# EasyEDA schematic Placa_CLP_2021-08-01_15-29-45.json
TITLE: Placa_CLP; REV: 1.0; Date: 01/07/2021; Sheet: 1/1; Drawn By: Fernando; Company: SENAI
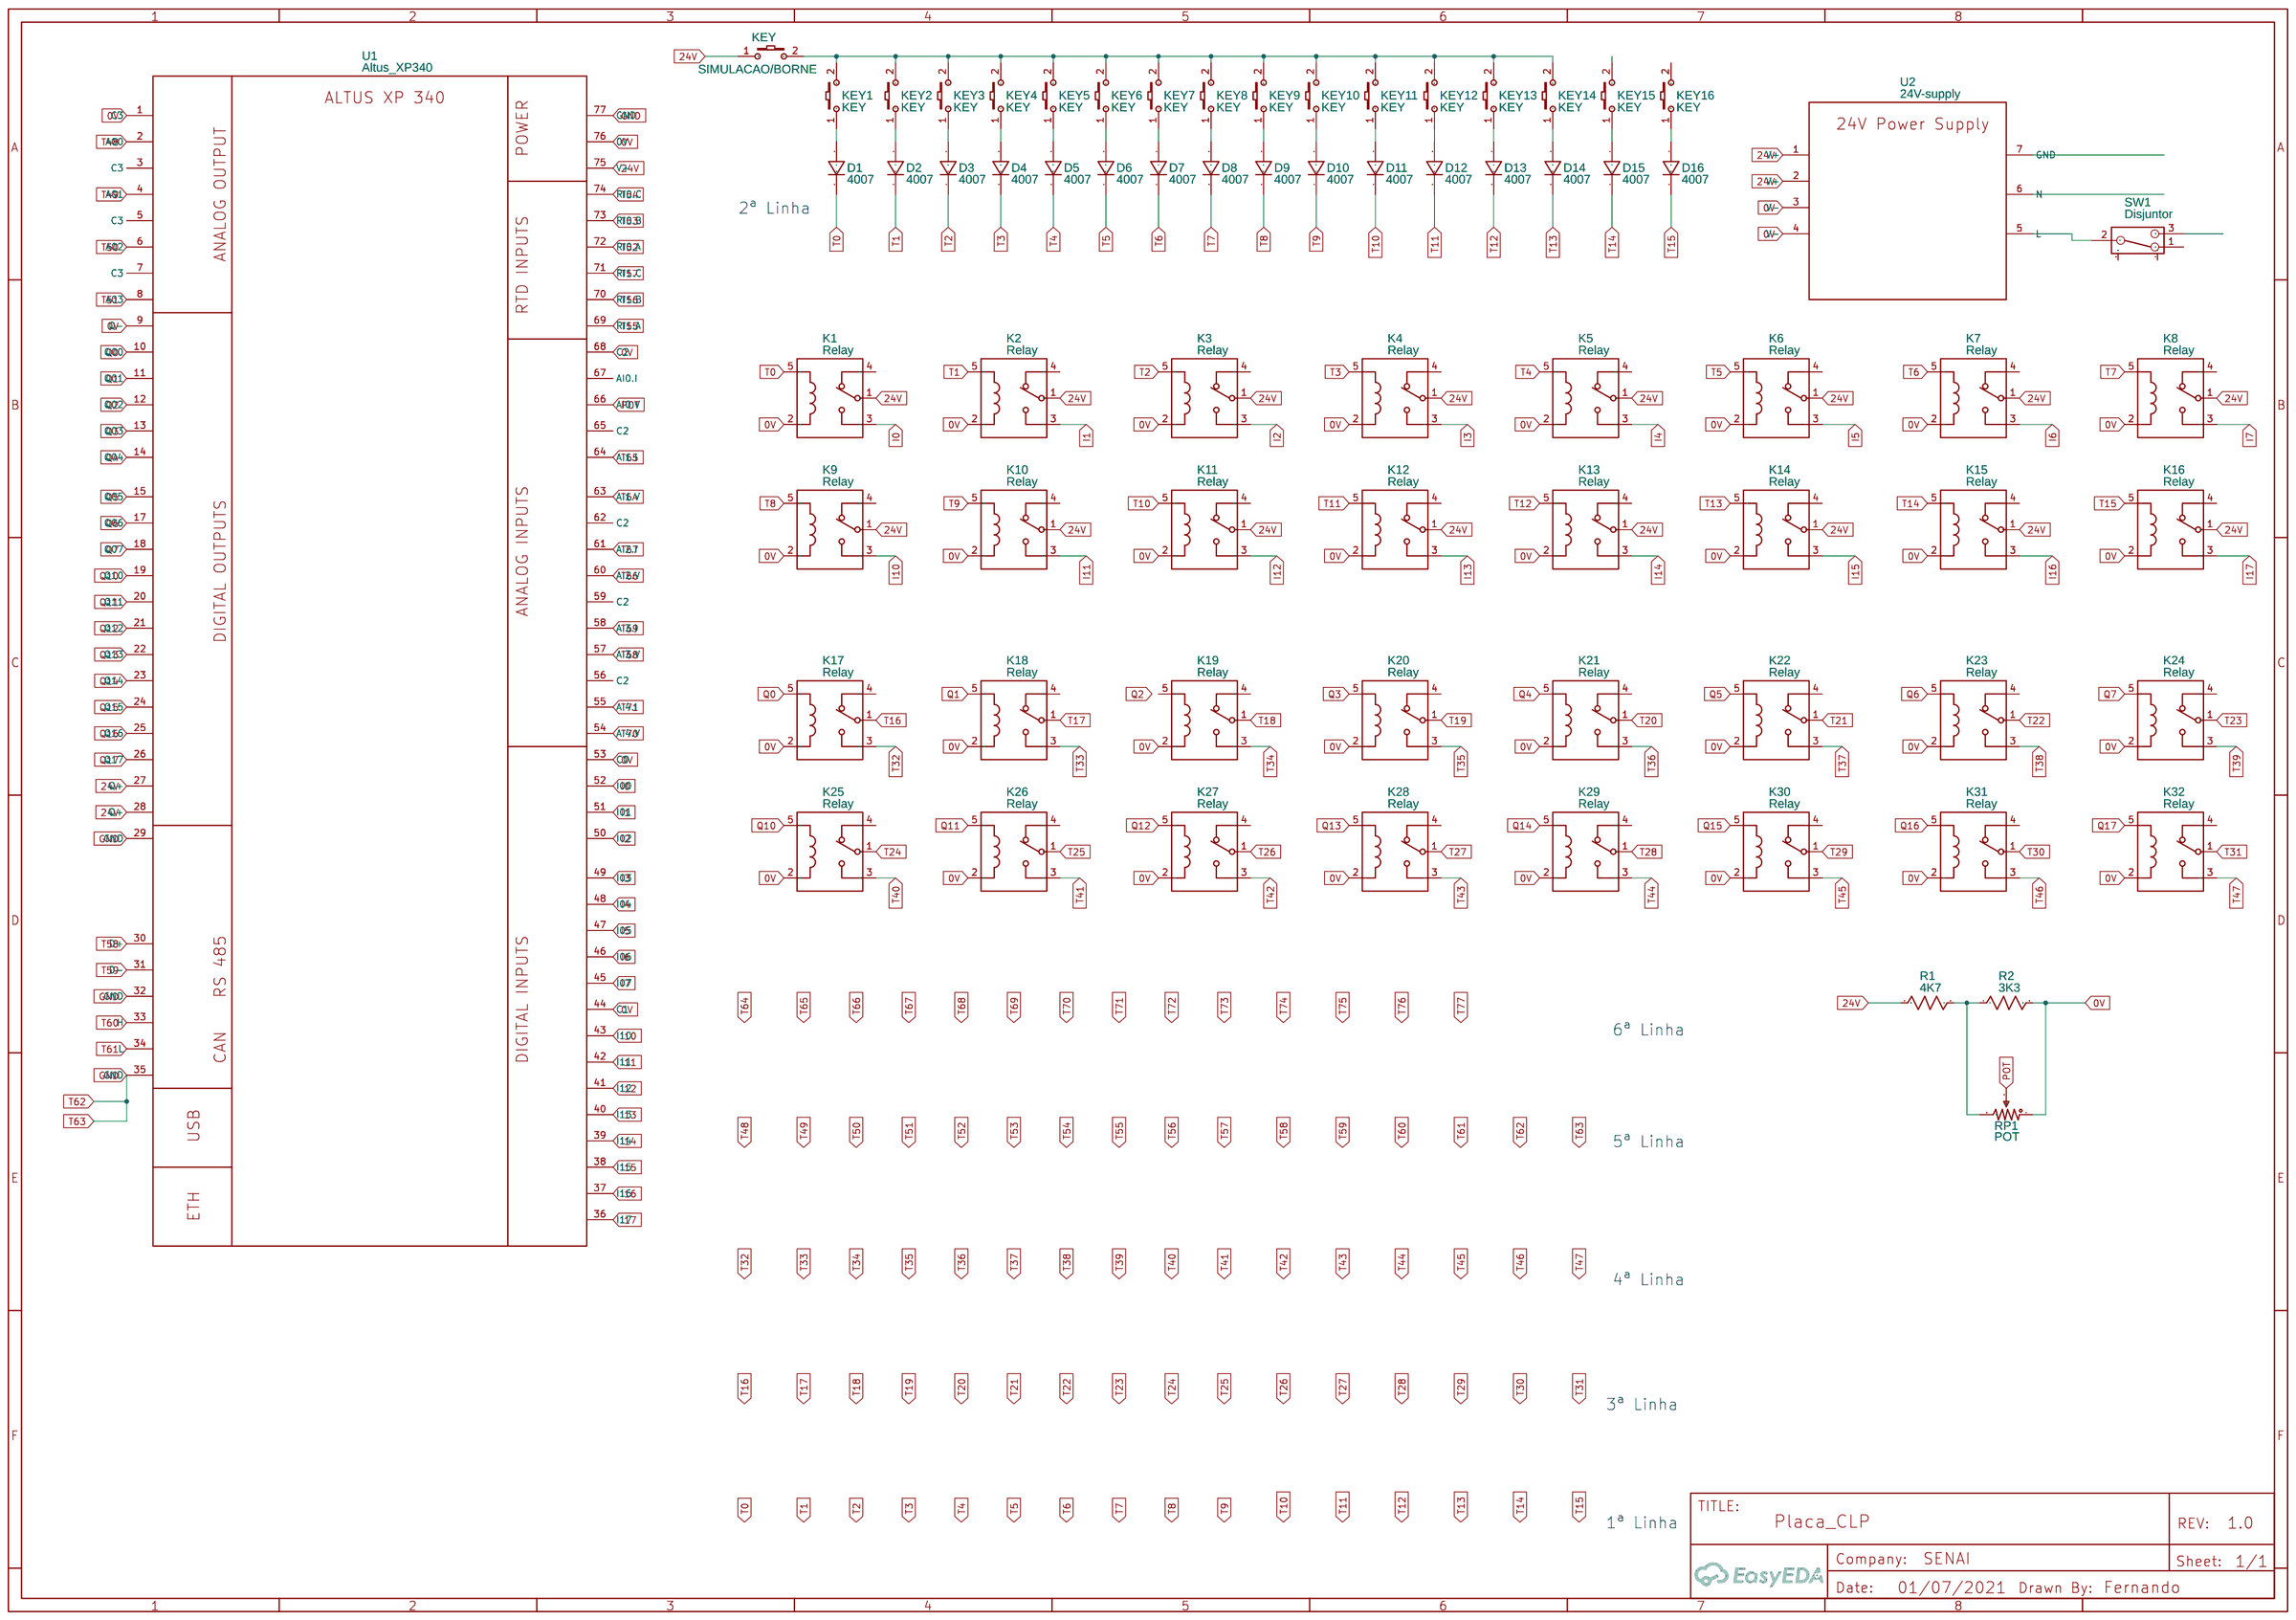
[diagram p0: schematic sheet]

## Parts
D1  4007  [DO-41_BD2.4-L4.7-P8.70-D0.9-RD]
D2  4007  [DO-41_BD2.4-L4.7-P8.70-D0.9-RD]
D3  4007  [DO-41_BD2.4-L4.7-P8.70-D0.9-RD]
D4  4007  [DO-41_BD2.4-L4.7-P8.70-D0.9-RD]
D5  4007  [DO-41_BD2.4-L4.7-P8.70-D0.9-RD]
D6  4007  [DO-41_BD2.4-L4.7-P8.70-D0.9-RD]
D7  4007  [DO-41_BD2.4-L4.7-P8.70-D0.9-RD]
D8  4007  [DO-41_BD2.4-L4.7-P8.70-D0.9-RD]
D9  4007  [DO-41_BD2.4-L4.7-P8.70-D0.9-RD]
D10  4007  [DO-41_BD2.4-L4.7-P8.70-D0.9-RD]
D11  4007  [DO-41_BD2.4-L4.7-P8.70-D0.9-RD]
D12  4007  [DO-41_BD2.4-L4.7-P8.70-D0.9-RD]
D13  4007  [DO-41_BD2.4-L4.7-P8.70-D0.9-RD]
D14  4007  [DO-41_BD2.4-L4.7-P8.70-D0.9-RD]
D15  4007  [DO-41_BD2.4-L4.7-P8.70-D0.9-RD]
D16  4007  [DO-41_BD2.4-L4.7-P8.70-D0.9-RD]
K1  Relay  [RELAY-TH_HT3F-DCXX-X-X]
K2  Relay  [RELAY-TH_HT3F-DCXX-X-X]
K3  Relay  [RELAY-TH_HT3F-DCXX-X-X]
K4  Relay  [RELAY-TH_HT3F-DCXX-X-X]
K5  Relay  [RELAY-TH_HT3F-DCXX-X-X]
K6  Relay  [RELAY-TH_HT3F-DCXX-X-X]
K7  Relay  [RELAY-TH_HT3F-DCXX-X-X]
K8  Relay  [RELAY-TH_HT3F-DCXX-X-X]
K9  Relay  [RELAY-TH_HT3F-DCXX-X-X]
K10  Relay  [RELAY-TH_HT3F-DCXX-X-X]
K11  Relay  [RELAY-TH_HT3F-DCXX-X-X]
K12  Relay  [RELAY-TH_HT3F-DCXX-X-X]
K13  Relay  [RELAY-TH_HT3F-DCXX-X-X]
K14  Relay  [RELAY-TH_HT3F-DCXX-X-X]
K15  Relay  [RELAY-TH_HT3F-DCXX-X-X]
K16  Relay  [RELAY-TH_HT3F-DCXX-X-X]
K17  Relay  [RELAY-TH_HT3F-DCXX-X-X]
K18  Relay  [RELAY-TH_HT3F-DCXX-X-X]
K19  Relay  [RELAY-TH_HT3F-DCXX-X-X]
K20  Relay  [RELAY-TH_HT3F-DCXX-X-X]
K21  Relay  [RELAY-TH_HT3F-DCXX-X-X]
K22  Relay  [RELAY-TH_HT3F-DCXX-X-X]
K23  Relay  [RELAY-TH_HT3F-DCXX-X-X]
K24  Relay  [RELAY-TH_HT3F-DCXX-X-X]
K25  Relay  [RELAY-TH_HT3F-DCXX-X-X]
K26  Relay  [RELAY-TH_HT3F-DCXX-X-X]
K27  Relay  [RELAY-TH_HT3F-DCXX-X-X]
K28  Relay  [RELAY-TH_HT3F-DCXX-X-X]
K29  Relay  [RELAY-TH_HT3F-DCXX-X-X]
K30  Relay  [RELAY-TH_HT3F-DCXX-X-X]
K31  Relay  [RELAY-TH_HT3F-DCXX-X-X]
K32  Relay  [RELAY-TH_HT3F-DCXX-X-X]
KEY1  KEY  [KEY-SMD_2P-L6.2-W3.6-LS8.0]
KEY2  KEY  [KEY-SMD_2P-L6.2-W3.6-LS8.0]
KEY3  KEY  [KEY-SMD_2P-L6.2-W3.6-LS8.0]
KEY4  KEY  [KEY-SMD_2P-L6.2-W3.6-LS8.0]
KEY5  KEY  [KEY-SMD_2P-L6.2-W3.6-LS8.0]
KEY6  KEY  [KEY-SMD_2P-L6.2-W3.6-LS8.0]
KEY7  KEY  [KEY-SMD_2P-L6.2-W3.6-LS8.0]
KEY8  KEY  [KEY-SMD_2P-L6.2-W3.6-LS8.0]
KEY9  KEY  [KEY-SMD_2P-L6.2-W3.6-LS8.0]
KEY10  KEY  [KEY-SMD_2P-L6.2-W3.6-LS8.0]
KEY11  KEY  [KEY-SMD_2P-L6.2-W3.6-LS8.0]
KEY12  KEY  [KEY-SMD_2P-L6.2-W3.6-LS8.0]
KEY13  KEY  [KEY-SMD_2P-L6.2-W3.6-LS8.0]
KEY14  KEY  [KEY-SMD_2P-L6.2-W3.6-LS8.0]
KEY15  KEY  [KEY-SMD_2P-L6.2-W3.6-LS8.0]
KEY16  KEY  [KEY-SMD_2P-L6.2-W3.6-LS8.0]
R1  4K7  [R0603]
R2  3K3  [R0603]
RP1  POT  [RES-ADJ-TH_3386P]
SIMULACAO/BORNE  KEY  [KEY-SMD_2P-L6.2-W3.6-LS8.0]
SW1  Disjuntor  [SW-TH_SK-12D02VG3]
U1  Altus_XP340
U2  24V-supply

## Library data of the parts
D1-D16 = 1N4007: Supplier: LCSC; Manufacturer: SEMTECH; Supplier Part: C106903; Contributor: LCEDA_Lib
K1-K32 = RelayHT3F-12VDC-SHG: Supplier: LCSC; Manufacturer: HTV; Supplier Part: C22022; JLCPCB Part Class: Extended Part
KEY1-KEY16 SIMULACAO/BORNE = K2-3.6×6.1_SMD: Supplier Part: C118141; Supplier: LCSC; Manufacturer Part: K2-1107ST-A4SW-06; Contributor: LCEDA_Lib; 制造商: 韩国韩荣
R1 R2 = R_0603_US: Contributor: LCEDA_Lib
RP1 = R_3386P_US: Supplier: LCSC; Contributor: LCEDA_Lib; value(Ω): 10K
SW1 = SK-12D02-VG5: Supplier: LCSC; Supplier Part: C136722; Manufacturer: Rectangular Connectors - Contacts; Contributor: LCSC
U1 = Altus_XP340: Contributor: D1Magus
U2 = 24V-supply: Contributor: D1Magus

## Nets
0V: K1.2 K2.2 K3.2 K4.2 K5.2 K6.2 K7.2 K8.2 K9.2 K10.2 K11.2 K12.2 K13.2 K14.2 K15.2 K16.2 K17.2 K18.2 K19.2 K20.2 K21.2 K22.2 K23.2 K24.2 K25.2 K26.2 K27.2 K28.2 K29.2 K30.2 K31.2 K32.2 R2.2 RP1.1
24V: K1.1 K2.1 K3.1 K4.1 K5.1 K6.1 K7.1 K8.1 K9.1 K10.1 K11.1 K12.1 K13.1 K14.1 K15.1 K16.1 R1.1 SIMULACAO/BORNE.1
I0: K1.3
I1: K2.3
I2: K3.3
I3: K4.3
I4: K5.3
I5: K6.3
I6: K7.3
I7: K8.3
I10: K9.3
I11: K10.3
I12: K11.3
I13: K12.3
I14: K13.3
I15: K14.3
I16: K15.3
I17: K16.3
POT: RP1.2
Q0: K17.5
Q1: K18.5
Q3: K20.5
Q4: K21.5
Q5: K22.5
Q6: K23.5
Q7: K24.5
Q10: K25.5
Q11: K26.5
Q12: K27.5
Q13: K28.5
Q14: K29.5
Q15: K30.5
Q16: K31.5
Q17: K32.5
T0: D1.1 K1.5
T1: D2.1 K2.5
T2: D3.1 K3.5
T3: D4.1 K4.5
T4: D5.1 K5.5
T5: D6.1 K6.5
T6: D7.1 K7.5
T7: D8.1 K8.5
T8: D9.1 K9.5
T9: D10.1 K10.5
T10: D11.1 K11.5
T11: D12.1 K12.5
T12: D13.1 K13.5
T13: D14.1 K14.5
T14: D15.1 K15.5
T15: D16.1 K16.5
T16: K17.1
T17: K18.1
T18: K19.1
T19: K20.1
T20: K21.1
T21: K22.1
T22: K23.1
T23: K24.1
T24: K25.1
T25: K26.1
T26: K27.1
T27: K28.1
T28: K29.1
T29: K30.1
T30: K31.1
T31: K32.1
T32: K17.3
T33: K18.3
T34: K19.3
T35: K20.3
T36: K21.3
T37: K22.3
T38: K23.3
T39: K24.3
T40: K25.3
T41: K26.3
T42: K27.3
T43: K28.3
T44: K29.3
T45: K30.3
T46: K31.3
T47: K32.3
Net-(D1-2): D1.2 KEY1.1
Net-(D2-2): D2.2 KEY2.1
Net-(D3-2): D3.2 KEY3.1
Net-(D4-2): D4.2 KEY4.1
Net-(D5-2): D5.2 KEY5.1
Net-(D6-2): D6.2 KEY6.1
Net-(D7-2): D7.2 KEY7.1
Net-(D8-2): D8.2 KEY8.1
Net-(D9-2): D9.2 KEY9.1
Net-(D10-2): D10.2 KEY10.1
Net-(D11-2): D11.2 KEY11.1
Net-(D12-2): D12.2 KEY12.1
Net-(D13-2): D13.2 KEY13.1
Net-(D14-2): D14.2 KEY14.1
Net-(D15-2): D15.2 KEY15.1
Net-(D16-2): D16.2 KEY16.1
Net-(KEY1-2): KEY1.2 KEY2.2 KEY3.2 KEY4.2 KEY5.2 KEY6.2 KEY7.2 KEY8.2 KEY9.2 KEY10.2 KEY11.2 KEY12.2 KEY13.2 KEY14.2 SIMULACAO/BORNE.2
Net-(R1-2): R1.2 R2.1 RP1.3

Not connected (* = marked no-connect by the designer): K1 4; K2 4; K3 4; K4 4; K5 4; K6 4; K7 4; K8 4; K9 4; K10 4; K11 4; K12 4; K13 4; K14 4; K15 4; K16 4; K17 4; K18 4; K19 4 5; K20 4; K21 4; K22 4; K23 4; K24 4; K25 4; K26 4; K27 4; K28 4; K29 4; K30 4; K31 4; K32 4; KEY15 2; KEY16 2; SW1 1 2 3 4 5; U1 1(C3) 2(A00) 3(C3) 4(A01) 5(C3) 6(A02) 7(C3) 8(A03) 9(Q-) 10(Q00) 11(Q01) 12(Q02) 13(Q03) 14(Q04) 15(Q05) 17(Q06) 18(Q07) 19(Q10) 20(Q11) 21(Q12) 22(Q13) 23(Q14) 24(Q15) 25(Q16) 26(Q17) 27(Q+) 28(Q+) 29(GND) 30(D+) 31(D-) 32(GND) 33(H) 34(L) 35(GND) 36(I17) 37(I16) 38(I15) 39(I14) 40(I13) 41(I12) 42(I11) 43(I10) 44(C1) 45(I07) 46(I06) 47(I05) 48(I04) 49(I03) 50(I02) 51(I01) 52(I00) 53(C0) 54(AI4.V) 55(AI4.I) 56(C2) 57(AI3.V) 58(AI3.I) 59(C2) 60(AI2.V) 61(AI2.I) 62(C2) 63(AI1.V) 64(AI1.I) 65(C2) 66(AI0.V) 67(AI0.I) 68(C2) 69(RI1.A) 70(RI1.B) 71(RI1.C) 72(RI0.A) 73(RI0.B) 74(RI0.C) 75(V+) 76(0V) 77(GND); U2 1(V+) 2(V+) 3(V-) 4(V-) 5(L) 6(N) 7(GND)

## Notes on the sheet
- 2ª Linha
- 6ª Linha
- 5ª Linha
- 4ª Linha
- 3ª Linha
- 1ª Linha
